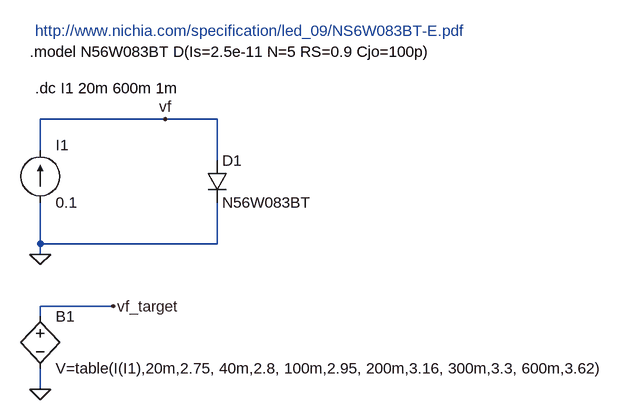
[diagram p0: schematic NS6W083BT_test.asc]
NS6W083BT_test.asc, the LTspice schematic file:
Version 4
SHEET 1 1020 680
WIRE 128 32 -64 32
WIRE 208 32 128 32
WIRE -64 80 -64 32
WIRE 208 96 208 32
WIRE -64 224 -64 160
WIRE 208 224 208 160
WIRE 208 224 -64 224
WIRE -64 240 -64 224
WIRE 48 320 -64 320
WIRE -64 336 -64 320
WIRE -64 448 -64 416
FLAG -64 240 0
FLAG -64 448 0
FLAG 128 32 vf
FLAG 48 320 vf_target
SYMBOL diode 192 96 R0
SYMATTR InstName D1
SYMATTR Value N56W083BT
SYMBOL current -64 160 M180
WINDOW 0 24 88 Left 0
WINDOW 3 24 0 Left 0
SYMATTR InstName I1
SYMATTR Value 0.1
SYMBOL bv -64 320 R0
SYMATTR InstName B1
SYMATTR Value V=table(I(I1),20m,2.75, 40m,2.8, 100m,2.95, 200m,3.16, 300m,3.3, 600m,3.62)
TEXT -72 -16 Left 0 !.dc I1 20m 600m 1m
TEXT -80 -72 Left 0 !.model N56W083BT D(Is=2.5e-11 N=5 RS=0.9 Cjo=100p)
TEXT -72 -104 Left 0 ;http://www.nichia.com/specification/led_09/NS6W083BT-E.pdf

The netlist it stands for:
* NS6W083BT_test.asc
D1 vf 0 N56W083BT
I1 0 vf 0.1
B1 vf_target 0 V=table(I(I1),20m,2.75, 40m,2.8, 100m,2.95, 200m,3.16, 300m,3.3, 600m,3.62)
.model D D
.lib standard.dio
.dc I1 20m 600m 1m
.model N56W083BT D(Is=2.5e-11 N=5 RS=0.9 Cjo=100p)
* http://www.nichia.com/specification/led_09/NS6W083BT-E.pdf
.backanno
.end